# Altium schematic sheet GaN_Half_Bridge3.SchDoc
size A4
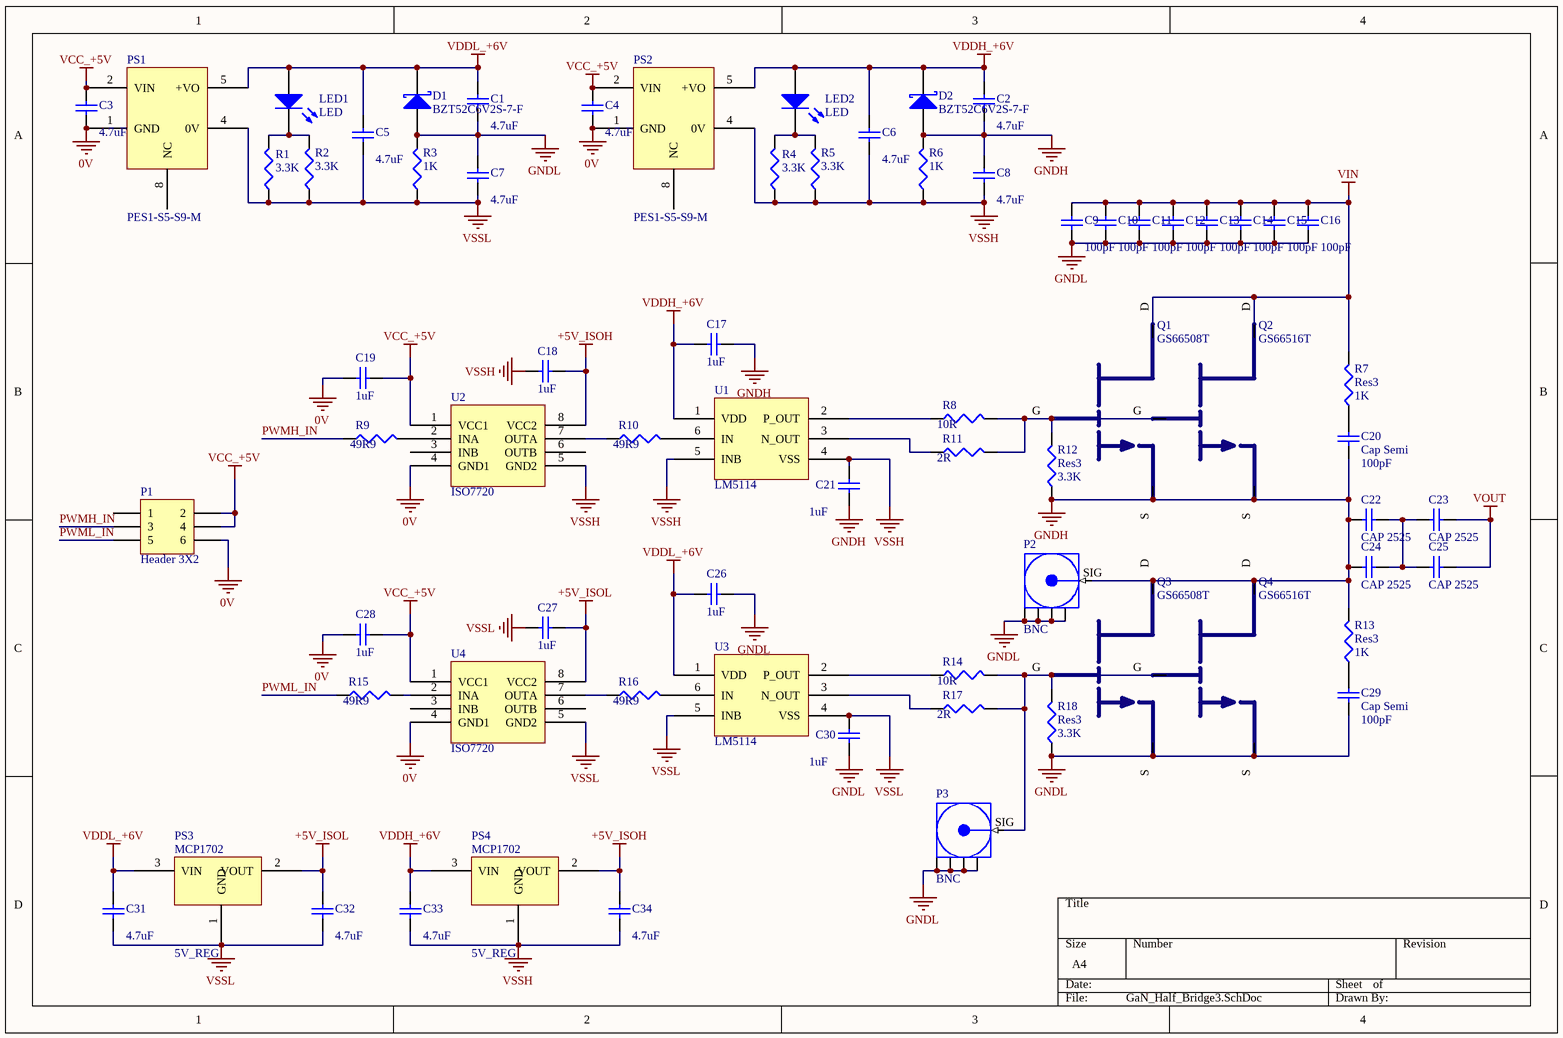
[diagram p0: GaN_Half_Bridge3.SchDoc]

## Parts
C1  value 4.7uF  [0805 IPC Low Density]  (hidden comment: Cap Semi)
C2  value 4.7uF  [0805 IPC Low Density]  (hidden comment: Cap Semi)
C3  value 4.7uF  [0805 IPC Low Density]  (hidden comment: Cap Semi)
C4  value 4.7uF  [0805 IPC Low Density]  (hidden comment: Cap Semi)
C5  value 4.7uF  [0805 IPC Low Density]  (hidden comment: Cap Semi)
C6  value 4.7uF  [0805 IPC Low Density]  (hidden comment: Cap Semi)
C7  value 4.7uF  [0805 IPC Low Density]  (hidden comment: Cap Semi)
C8  value 4.7uF  [0805 IPC Low Density]  (hidden comment: Cap Semi)
C9  value 100pF  [1812 IPC Low Density]  (hidden comment: Cap Semi)
C10  value 100pF  [1812 IPC Low Density]  (hidden comment: Cap Semi)
C11  value 100pF  [1812 IPC Low Density]  (hidden comment: Cap Semi)
C12  value 100pF  [1812 IPC Low Density]  (hidden comment: Cap Semi)
C13  value 100pF  [1812 IPC Low Density]  (hidden comment: Cap Semi)
C14  value 100pF  [1812 IPC Low Density]  (hidden comment: Cap Semi)
C15  value 100pF  [1812 IPC Low Density]  (hidden comment: Cap Semi)
C16  value 100pF  [1812 IPC Low Density]  (hidden comment: Cap Semi)
C17  value 1uF  [0603 IPC Low Density]  (hidden comment: Cap Semi)
C18  value 1uF  [0603 IPC Low Density]  (hidden comment: Cap Semi)
C19  value 1uF  [0603 IPC Low Density]  (hidden comment: Cap Semi)
C20  Cap Semi  value 100pF  [1206 IPC Low Density]
C21  value 1uF  [0603 IPC Low Density]  (hidden comment: Cap Semi)
C22  CAP 2525  [CAP 2525]
C23  CAP 2525  [CAP 2525]
C24  CAP 2525  [CAP 2525]
C25  CAP 2525  [CAP 2525]
C26  value 1uF  [0603 IPC Low Density]  (hidden comment: Cap Semi)
C27  value 1uF  [0603 IPC Low Density]  (hidden comment: Cap Semi)
C28  value 1uF  [0603 IPC Low Density]  (hidden comment: Cap Semi)
C29  Cap Semi  value 100pF  [1206 IPC Low Density]
C30  value 1uF  [0603 IPC Low Density]  (hidden comment: Cap Semi)
C31  value 4.7uF  [0805 IPC Low Density]  (hidden comment: Cap Semi)
C32  value 4.7uF  [0805 IPC Low Density]  (hidden comment: Cap Semi)
C33  value 4.7uF  [0805 IPC Low Density]  (hidden comment: Cap Semi)
C34  value 4.7uF  [0805 IPC Low Density]  (hidden comment: Cap Semi)
D1  BZT52C6V2S-7-F  [SOD-323]
D2  BZT52C6V2S-7-F  [SOD-323]
LED1  LED  [LED 0603]
LED2  LED  [LED 0603]
P1  Header 3X2  [HDR2X3]
P2  BNC  [BNC]
P3  BNC  [BNC]
PS1  PES1-S5-S9-M  [PES1-S5-S9-M]
PS2  PES1-S5-S9-M  [PES1-S5-S9-M]
PS3  5V_REG  [SOT23-3]
PS4  5V_REG  [SOT23-3]
Q1  GS66508T  [GS66508T]
Q2  GS66516T  [GS66516T]
Q3  GS66508T  [GS66508T]
Q4  GS66516T  [GS66516T]
R1  value 3.3K  [RESISTOR 0603]  (hidden comment: Res3)
R2  value 3.3K  [RESISTOR 0603]  (hidden comment: Res3)
R3  value 1K  [RESISTOR 0603]  (hidden comment: Res3)
R4  value 3.3K  [RESISTOR 0603]  (hidden comment: Res3)
R5  value 3.3K  [RESISTOR 0603]  (hidden comment: Res3)
R6  value 1K  [RESISTOR 0603]  (hidden comment: Res3)
R7  Res3  value 1K  [RESISTOR 1206]
R8  value 10R  [RESISTOR 0603]  (hidden comment: Res3)
R9  value 49R9  [RESISTOR 0603]  (hidden comment: Res3)
R10  value 49R9  [RESISTOR 0603]  (hidden comment: Res3)
R11  value 2R  [RESISTOR 0603]  (hidden comment: Res3)
R12  Res3  value 3.3K  [RESISTOR 0603]
R13  Res3  value 1K  [RESISTOR 1206]
R14  value 10R  [RESISTOR 0603]  (hidden comment: Res3)
R15  value 49R9  [RESISTOR 0603]  (hidden comment: Res3)
R16  value 49R9  [RESISTOR 0603]  (hidden comment: Res3)
R17  value 2R  [RESISTOR 0603]  (hidden comment: Res3)
R18  Res3  value 3.3K  [RESISTOR 0603]
U1  LM5114  [WSON]
U2  ISO7720  [SOIC8_N]
U3  LM5114  [WSON]
U4  ISO7720  [SOIC8_N]

## Nets
0V: C3.1 C4.1 C19.2 C28.2 P1.6 PS1.1(GND) PS2.1(GND) U2.4(GND1) U4.4(GND1)
+5V_ISOH: C18.1 C34.2 PS4.2(VOUT) U2.8(VCC2)
+5V_ISOL: C27.1 C32.2 PS3.2(VOUT) U4.8(VCC2)
GNDH: C2.1 C8.2 C17.1 C20.1 C21.1 C22.1 C24.1 D2.1(A) P2.SIG(Signal) Q1.S Q2.S Q3.D Q4.D R6.2 R12.1 R13.2
GNDL: C1.1 C7.2 C9.1 C10.1 C11.1 C12.1 C13.1 C14.1 C15.1 C16.1 C26.1 C29.1 C30.1 D1.1(A) P2.GND P3.GND Q3.S Q4.S R3.2 R18.1
VCC_+5V: C3.2 C4.2 C19.1 C28.1 P1.2 P1.4 PS1.2(VIN) PS2.2(VIN) U2.1(VCC1) U4.1(VCC1)
VDDH_+6V: C2.2 C6.2 C17.2 C33.2 D2.3(K) LED2.1(A) PS2.5(+VO) PS4.3(VIN) U1.1(VDD)
VDDL_+6V: C1.2 C5.2 C26.2 C31.2 D1.3(K) LED1.1(A) PS1.5(+VO) PS3.3(VIN) U3.1(VDD)
VIN: C9.2 C10.2 C11.2 C12.2 C13.2 C14.2 C15.2 C16.2 Q1.D Q2.D R7.2
VOUT: C23.2 C25.2
VSSH: C6.1 C8.1 C18.2 C21.2 C33.1 C34.1 PS2.4(0V) PS4.1(GND) R4.1 R5.1 R6.1 U1.4(VSS) U1.5(INB) U2.5(GND2)
VSSL: C5.1 C7.1 C27.2 C30.2 C31.1 C32.1 PS1.4(0V) PS3.1(GND) R1.1 R2.1 R3.1 U3.4(VSS) U3.5(INB) U4.5(GND2)
PWMH_IN: P1.3 R9.1
PWML_IN: P1.5 R15.1
NetC20_2: C20.2 R7.1
NetC22_2: C22.2 C23.1 C24.2 C25.1
NetC29_2: C29.2 R13.1
NetLED1_2: LED1.2(K) R1.2 R2.2
NetLED2_2: LED2.2(K) R4.2 R5.2
NetP3_SIG: P3.SIG(Signal) Q3.G Q4.G R14.2 R17.2 R18.2
NetQ1_G: Q1.G Q2.G R8.2 R11.2 R12.2
NetR8_1: R8.1 U1.2(P_OUT)
NetR9_2: R9.2 U2.2(INA)
NetR10_1: R10.1 U2.7(OUTA)
NetR10_2: R10.2 U1.6(IN)
NetR11_1: R11.1 U1.3(N_OUT)
NetR14_1: R14.1 U3.2(P_OUT)
NetR15_2: R15.2 U4.2(INA)
NetR16_1: R16.1 U4.7(OUTA)
NetR16_2: R16.2 U3.6(IN)
NetR17_1: R17.1 U3.3(N_OUT)

Not connected (* = marked no-connect by the designer): P1 1; PS1 8(NC); PS2 8(NC); U2 3(INB) 6(OUTB); U4 3(INB) 6(OUTB)

## Notes on the sheet
- (in symbol 5V_REG) MCP1702

## Library data of the parts
C1-C21 C26-C34 = Cap Semi: Capacitor (Semiconductor SIM Model); Published: 8-Jun-2000; LatestRevisionDate: 29-May-2009; LatestRevisionNote: IPC-7351 Footprint Added.; PackageReference: C1206; Publisher: Altium Limited; PackageDescription: Chip Capacitor
D1 D2 = BZT52C6V2S-7-F: Zener Diodes 6.2V 200mW
LED1 LED2 = LED: SML-D12U1WT86
P1 = Header 3X2: Header, 3-Pin, Dual row; LatestRevisionDate: 17-Jul-2002; LatestRevisionNote: Re-released for DXP Platform.; Publisher: Altium Limited
P2 P3 = BNC: Straight 50Ω Through Hole BNC Connector; PackageDocument: Rev. A, 16-Jun-1997; PCB_Layout: Complies with manufacturer's recommendation.; DrillSize: Corresponds to nominal value.; Published: 15-Jul-2004; LatestRevisionDate: 15-Jul-2004; LatestRevisionNote: Component Replaced.; DatasheetDocument: 30-May-2003; PackageReference: 908-21103; Publisher: Altium Limited; ComponentLink1Description: Manufacturer Link; ComponentLink1URL: http://www.amphenolrf.com/
Q1 Q3 = GS66508P: 650 V E-HEMT - Top Side Cooled; Mfr 1: GaN Systems; Mfr 1 PN: GS66508P
Q2 Q4 = GS66516T: Top-side cooled 650 V E-mode GaN transistor
R1-R18 = Res3: Resistor; Published: 8-Jun-2000; LatestRevisionDate: 29-May-2009; LatestRevisionNote: IPC-7351 Footprint Added.; PackageReference: J1-0603; Publisher: Altium Limited; PackageDescription: Chip Resistor